# Altium schematic sheet GLCD.SchDoc
size A4; SheetNumber: 6; SheetTotal: 12
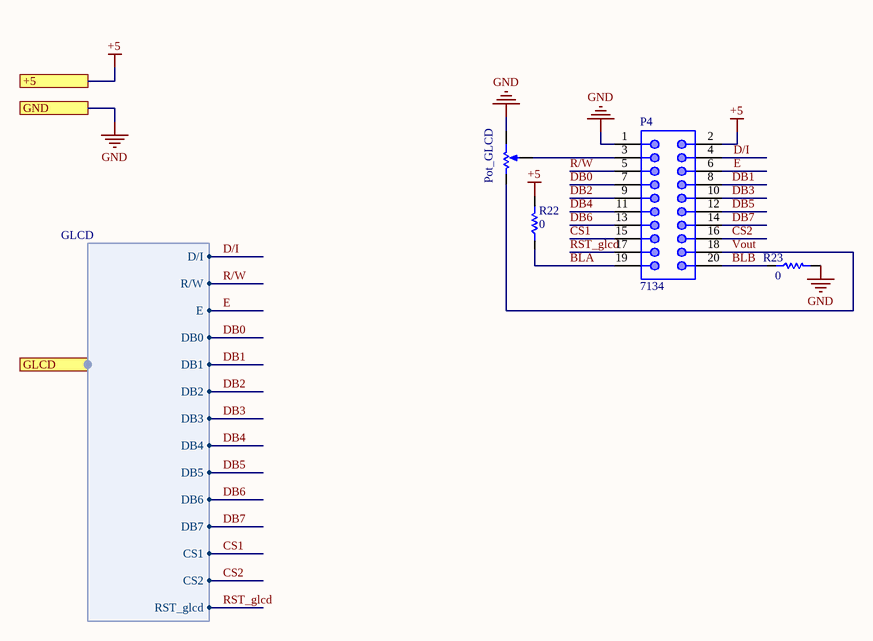
[diagram p0: GLCD.SchDoc]

## Parts
P4  Inflow: 7134  [BOX-HDR-10X2-2.54mm-S]  (hidden comment: 10x2)
Pot_GLCD  10K  [Multi turn 01]  (value not drawn)
R22  0  [RES 1206 (3216X08L)]
R23  0  [RES 1206 (3216X08L)]

## Ports
+5, GLCD (harness GLCD), GND

## Harnesses
GLCD: D/I, R/W, E, DB0, DB1, DB2, DB3, DB4, DB5, DB6, DB7, CS1, CS2, RST_glcd

## Nets
+5: P4.2 R22.2 ; port +5
GND: P4.1 Pot_GLCD.1 R23.2 ; port GND
BLA: P4.19 R22.1
BLB: P4.20 R23.1
CS1: P4.15 ; port GLCD.CS1
CS2: P4.16 ; port GLCD.CS2
D/I: P4.4 ; port GLCD.D/I
DB0: P4.7 ; port GLCD.DB0
DB1: P4.8 ; port GLCD.DB1
DB2: P4.9 ; port GLCD.DB2
DB3: P4.10 ; port GLCD.DB3
DB4: P4.11 ; port GLCD.DB4
DB5: P4.12 ; port GLCD.DB5
DB6: P4.13 ; port GLCD.DB6
DB7: P4.14 ; port GLCD.DB7
E: P4.6 ; port GLCD.E
R/W: P4.5 ; port GLCD.R/W
RST_glcd: P4.17 ; port GLCD.RST_glcd
Vout: P4.18 Pot_GLCD.3
NetP4_3: P4.3 Pot_GLCD.2

## Library data of the parts
P4 = Con_IDC_10x2: Male Box Header, 20 pins; Rating: Rating?; Validation: NT; Value: 10x2; Package: Package?; Type: Type?
Pot_GLCD = Res_Multi: Multi Turn; Rating: Rating?; Validation: Valid; Inflow: inflow?; Package: Package?; Type: Type?; Value: 10K
R22 R23 = Res_SMD_1206: Resistor; Inflow: inflow?; Rating: 0.25W; Validation: Valid; Package: 1206; Type: 10%; Value: 0